# EAGLE design ALA_BOARD (EAGLE 9.6.2)
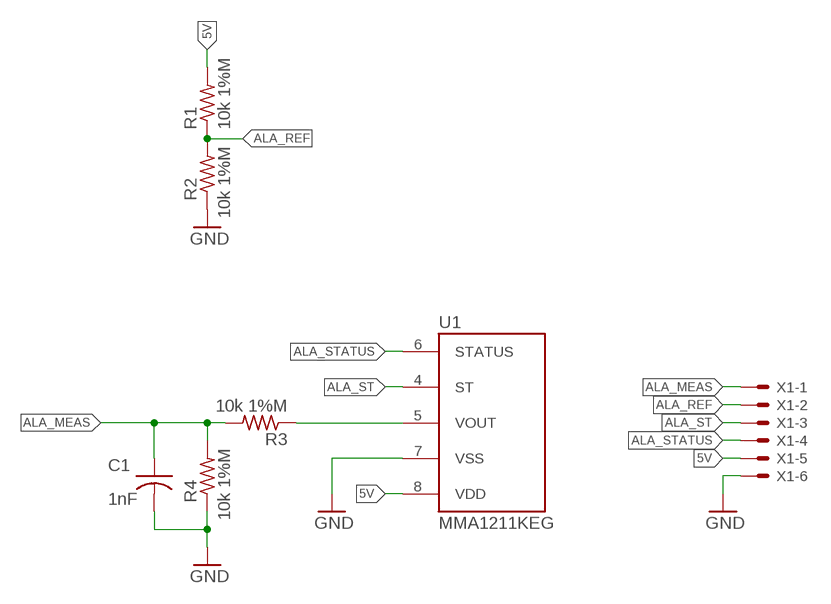
[diagram p0: schematic, sheet 1]

## Parts
C1  1nF  C-USC0805  [C0805]
R1  10k 1%M  R-US_R0805  [R0805]
R2  10k 1%M  R-US_R0805  [R0805]
R3  10k 1%M  R-US_R0805  [R0805]
R4  10k 1%M  R-US_R0805  [R0805]
U1  MMA1211KEG  [SOIC127P1041X355-16N]
X1  22-23-2061  [22-23-2061]

## Nets
5V: R1.2 U1.8(VDD) X1.5
ALA_MEAS: C1.1 R3.2 R4.2 X1.1
ALA_REF: R1.1 R2.2 X1.2
ALA_ST: U1.4(ST) X1.3
ALA_STATUS: U1.6(STATUS) X1.4
GND: C1.2 R2.1 R4.1 U1.7(VSS) X1.6
VOUT: R3.1 U1.5(VOUT)

## Library data of the parts
C1 = rcl:C-US: CAPACITOR, American symbol; SPICEPREFIX: C
R1-R4 = rcl:R-US_: RESISTOR, American symbol; SPICEPREFIX: R
U1 = MITCH Shield:MMA1211KEG
X1 = con-molex:22-23-2061: .100" (2.54mm) Center Header - 6 Pin; MF: MOLEX; MPN: 22-23-2061; OC_FARNELL: 1462922; OC_NEWARK: 27C1933

## Board
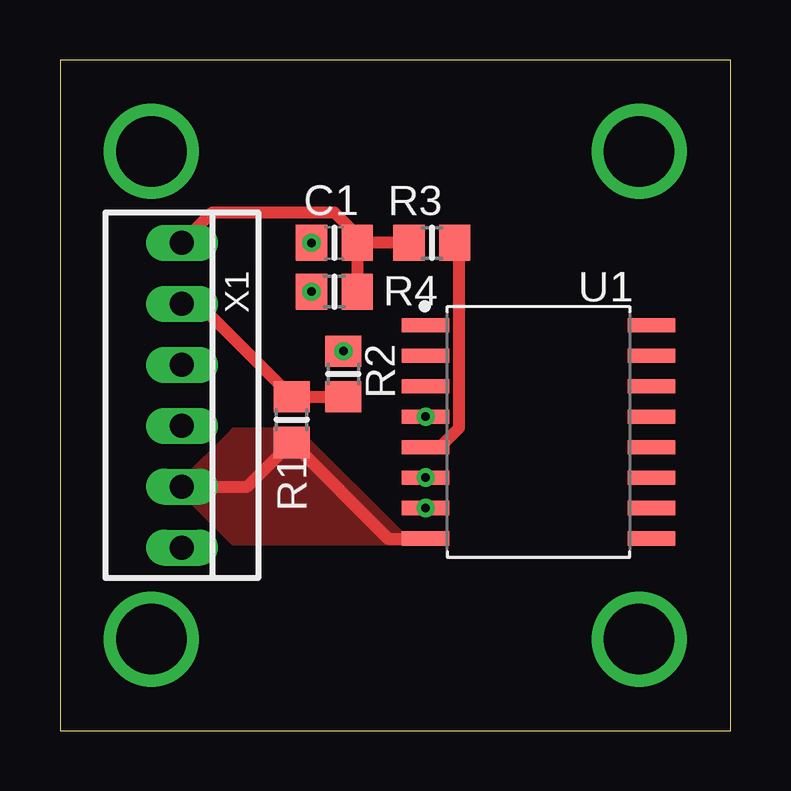
[diagram p1: board, top side]
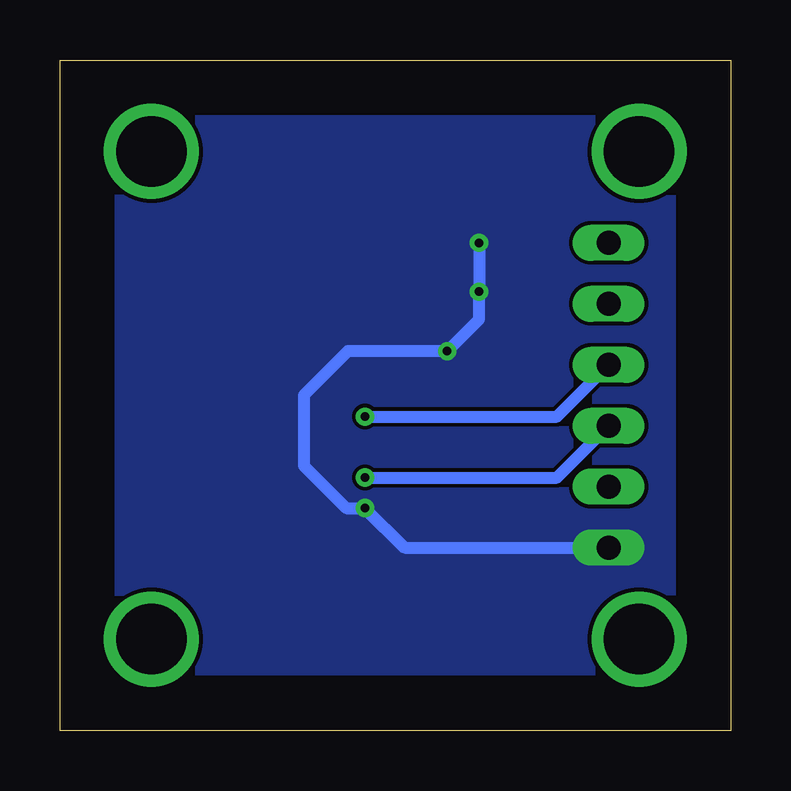
[diagram p2: board, bottom side, seen from below]

Size 27.94 x 27.94 mm. Coordinates in mm from the lower left corner, seen from the top.
Outline: 0,0 27.94,0 27.94,27.94 0,27.94 0,0
Copper layers (1*16): Top 0.035mm / dielectric 1.5mm / Bottom 0.035mm
Design rules "default": minimum track width 6mil, minimum drill 0.35mm, track to track 6mil, track to pad 6mil, pad to pad 6mil, via to via 6mil, smd to smd 6mil, copper to edge 40mil, drill to drill 6mil, minimum pad ring 10mil, minimum via ring 8mil, stop-mask expansion 4mil, vias tented up to drill 0mil, thermal gap 10mil

### Footprints (pad centres in the part's own frame; a part is rotated, then mirrored left to right if it is on the bottom)
C0805 = smd 1.3 x 1.5: 1 -0.95,0; 2 0.95,0
R0805 = smd 1.3 x 1.5: 1 -0.95,0; 2 0.95,0
SOIC127P1041X355-16N = smd 1.973 x 0.589: 1 -4.705,4.445; 2 -4.705,3.175; 3 -4.705,1.905; 4 -4.705,0.635; 5 -4.705,-0.635; 6 -4.705,-1.905; 7 -4.705,-3.175; 8 -4.705,-4.445; 9 4.705,-4.445; 10 4.705,-3.175; 11 4.705,-1.905; 12 4.705,-0.635; 13 4.705,0.635; 14 4.705,1.905; 15 4.705,3.175; 16 4.705,4.445
22-23-2061 = drill 1 long: 1 -6.35,0; 2 -3.81,0; 3 -1.27,0; 4 1.27,0; 5 3.81,0; 6 6.35,0

### Placement (x,y rotation side)
C1  11.43,20.32 180 top
R1  9.65,12.95 270 top
R2  11.81,14.86 270 top
R3  15.49,20.32 180 top
R4  11.43,18.29 0 top
U1  19.94,12.45 0 top
X1  5.08,13.97 270 top

### Tracks (layer width: path | path; a pad name or v marks a point on that pad's centre or on a via)
5V
  Top 0.508: X1.5 7.81,10.16 R1.2 13.65,8 U1.8
  pour Top (no thermals): 5.08,10.16 7.32,12.4 9.83,12.4 14.27,7.95 7.29,7.95
ALA_MEAS
  Top 0.508: X1.1 6.35,21.59 11.43,21.59 12.38,20.64 | 12.38,20.64 C1.1 R4.2 | R3.2 12.7,20.32 12.38,20.64
ALA_REF
  Top 0.508: X1.2 5.78,17.78 R1.1 R2.2
ALA_ST  (via drill 0.35)
  Bottom 0.508: U1.4 7.24,13.08 X1.3
  other vias: 15.23,13.08
ALA_STATUS  (via drill 0.35)
  Bottom 0.508: U1.6 7.24,10.54 X1.4
  other vias: 15.23,10.54
GND  (via drill 0.35)
  Bottom 0.508: X1.6 13.58,7.62 U1.7 16.01,9.27 17.78,11.04 17.78,13.97 15.94,15.81 R2.1 10.48,17.14 R4.1 C1.2
  other vias: 15.23,9.27 11.81,15.81 10.48,18.29 10.48,20.32
  pour Bottom (no thermals): 2.54,25.4 2.54,2.54 25.4,2.54 25.4,25.4
N$1  (via drill 2.95)
  other vias: 3.81,3.81
N$2  (via drill 2.95)
  other vias: 24.13,3.81
N$3  (via drill 2.95)
  other vias: 24.13,24.13
N$4  (via drill 2.95)
  other vias: 3.81,24.13
VOUT
  Top 0.508: R3.1 16.63,20.14 16.63,12.62 15.82,11.81 U1.5